# Altium schematic sheet IR2110.SchDoc
size A3; SheetNumber: 1; SheetTotal: 5
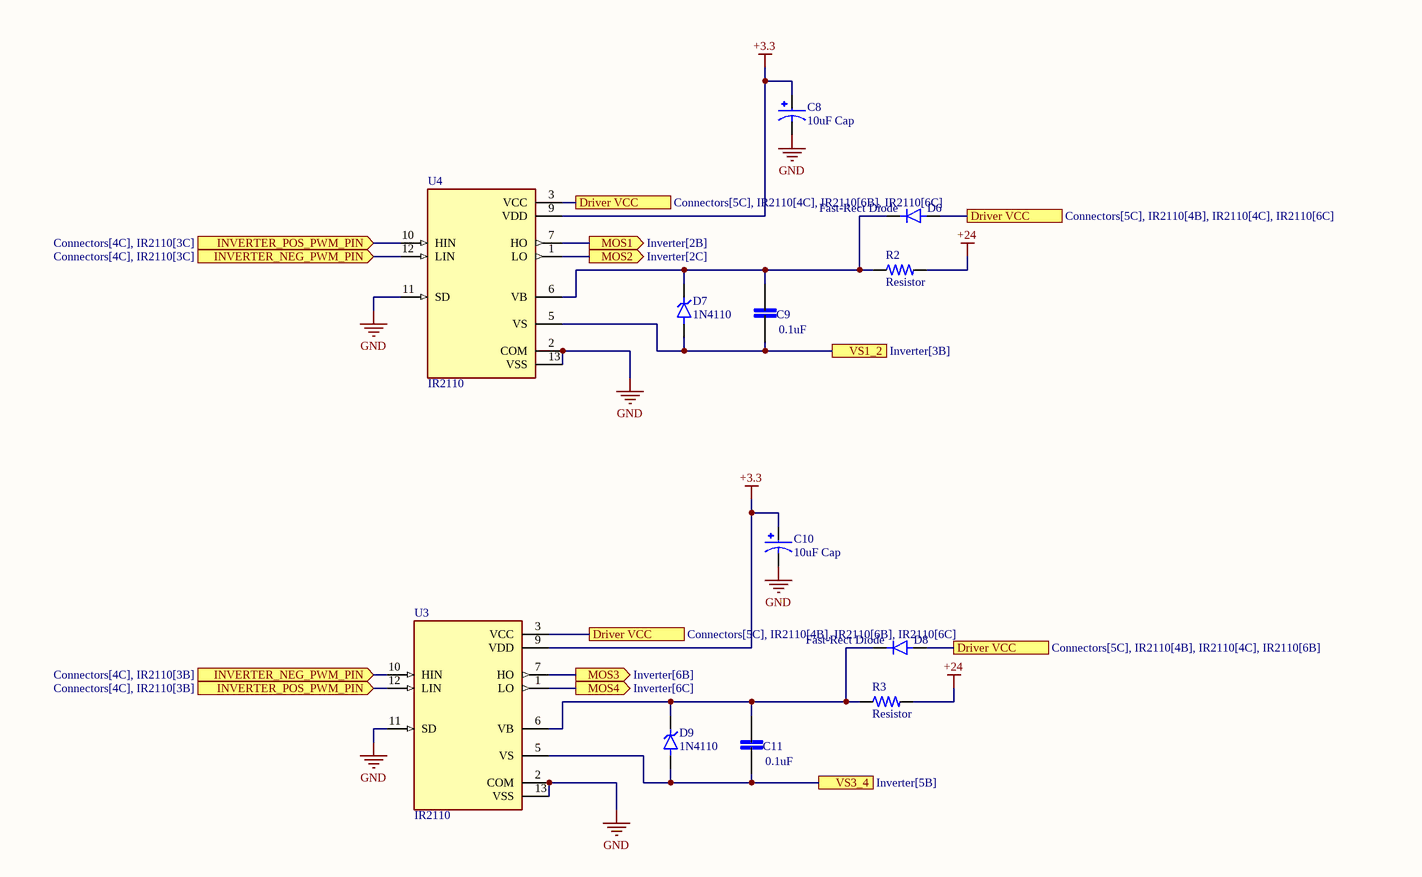
[diagram p0: IR2110.SchDoc]

## Parts
C8  10uF Cap  [CAP_10uF]
C9  0.1uF  [Ceramic Capacitor]
C10  10uF Cap  [CAP_10uF]
C11  0.1uF  [Ceramic Capacitor]
D6  Fast-Rect Diode  [Common Trhough Hole]
D7  1N4110  [Common Trhough Hole]
D8  Fast-Rect Diode  [Common Trhough Hole]
D9  1N4110  [Common Trhough Hole]
R2  Resistor  [Resistor_Through Hole]
R3  Resistor  [Resistor_Through Hole]
U3  IR2110  [IR2110]
U4  IR2110  [IR2110]

## Ports
Driver VCC (see Connectors[5C], IR2110[4B], IR2110[4C], IR2110[6B]), Driver VCC (see Connectors[5C], IR2110[4B], IR2110[4C], IR2110[6C]), Driver VCC (see Connectors[5C], IR2110[4B], IR2110[6B], IR2110[6C]), Driver VCC (see Connectors[5C], IR2110[4C], IR2110[6B], IR2110[6C]), INVERTER_NEG_PWM_PIN (in, see Connectors[4C], IR2110[3B]), INVERTER_NEG_PWM_PIN (in, see Connectors[4C], IR2110[3C]), INVERTER_POS_PWM_PIN (in, see Connectors[4C], IR2110[3B]), INVERTER_POS_PWM_PIN (in, see Connectors[4C], IR2110[3C]), MOS1 (out, see Inverter[2B]), MOS2 (out, see Inverter[2C]), MOS3 (out, see Inverter[6B]), MOS4 (out, see Inverter[6C]), VS1_2 (see Inverter[3B]), VS3_4 (see Inverter[5B])

## Nets
+3.3: C8.P C10.P U3.9(VDD) U4.9(VDD)
+24: R2.2 R3.2
GND: C8.N C10.N U3.2(COM) U3.11(SD) U3.13(VSS) U4.2(COM) U4.11(SD) U4.13(VSS)
Driver VCC: D6.2(A) D8.2(A) U3.3(VCC) U4.3(VCC) ; port Driver VCC
INVERTER_NEG_PWM_PIN: U3.10(HIN) U4.12(LIN) ; port INVERTER_NEG_PWM_PIN
INVERTER_POS_PWM_PIN: U3.12(LIN) U4.10(HIN) ; port INVERTER_POS_PWM_PIN
MOS1: U4.7(HO) ; port MOS1
MOS2: U4.1(LO) ; port MOS2
MOS3: U3.7(HO) ; port MOS3
MOS4: U3.1(LO) ; port MOS4
VS1_2: C9.1 D7.2(A) U4.5(VS) ; port VS1_2
VS3_4: C11.1 D9.2(A) U3.5(VS) ; port VS3_4
NetC9_2: C9.2 D6.1(K) D7.1(K) R2.1 U4.6(VB)
NetC11_2: C11.2 D8.1(K) D9.1(K) R3.1 U3.6(VB)

## Library data of the parts
C8 C10 = 10uF Cap: CAP ALUM 10UF 20% 50V RADIAL; MP: ECE-A1HN100UI; MF: Panasonic; SnapEDA_Link: https://www.snapeda.com/parts/ECE-A1HN100UI/Panasonic/view-part/2321690/?ref=snap; Price: None; Check_prices: https://www.snapeda.com/parts/ECE-A1HN100UI/Panasonic/view-part/2321690/?ref=eda; Value: *; Availability: In Stock; Package: RADIAL-2 Panasonic
C9 C11 = Ceramic Capacitor: MP: LD051A121KAB2A; MF: AVX; SnapEDA_Link: https://www.snapeda.com/parts/LD051A121KAB2A/AVX/view-part/?ref=snap; Package: 0805 AVX; Check_prices: https://www.snapeda.com/parts/LD051A121KAB2A/AVX/view-part/?ref=eda; Purchase-URL: https://pricing.snapeda.com/search/part/LD051A121KAB2A/?ref=eda; Price: None; Value: *; Availability: In Stock
D6 D8 = Normal Diode: MF: NTE Electronics, Inc.; MP: 1N4007; Package: DO-41 NTE Electronics; Check_prices: https://www.snapeda.com/parts/1N4007/NTE+Electronics/view-part/?ref=eda; Value: *; Purchase-URL: https://pricing.snapeda.com/search/part/1N4007/?ref=eda; Availability: In Stock; SnapEDA_Link: https://www.snapeda.com/parts/1N4007/NTE+Electronics/view-part/?ref=snap; Price: None
D7 D9 = Zener Diode: MP: 1SMA5926; MF: Taiwan Semiconductor; Package: SMA-2 Taiwan Semiconductor; Availability: In Stock; Purchase-URL: https://pricing.snapeda.com/search/part/1SMA5926/?ref=eda; SnapEDA_Link: https://www.snapeda.com/parts/1SMA5926/Taiwan+Semiconductor/view-part/?ref=snap; Price: None; Check_prices: https://www.snapeda.com/parts/1SMA5926/Taiwan+Semiconductor/view-part/?ref=eda; Value: *
R2 R3 = Resistor: Power_Rating: .25 W; MP: 2-2176053-0; Tolerance: 1%; Resistance: .33; MF: TE Connectivity; Price: None; Availability: In Stock; EU_RoHS_Compliance: Compliant with Exemptions; Package: 0805; Value: *; SnapEDA_Link: https://www.snapeda.com/parts/2-2176053-0/TE+Connectivity/view-part/?ref=snap; Check_prices: https://www.snapeda.com/parts/2-2176053-0/TE+Connectivity/view-part/?ref=eda
U3 U4 = IR2110: Half-Bridge Gate Driver IC Non-Inverting 16-SOIC; MF: Infineon; Package: SOIC-16 International Rectifier; Purchase-URL: https://pricing.snapeda.com/search/part/IR2110/?ref=eda; Value: *; SnapEDA_Link: https://www.snapeda.com/parts/IR2110/Infineon+Technologies/view-part/?ref=snap; Price: None; MP: IR2110; Check_prices: https://www.snapeda.com/parts/IR2110/Infineon+Technologies/view-part/?ref=eda; Availability: In Stock